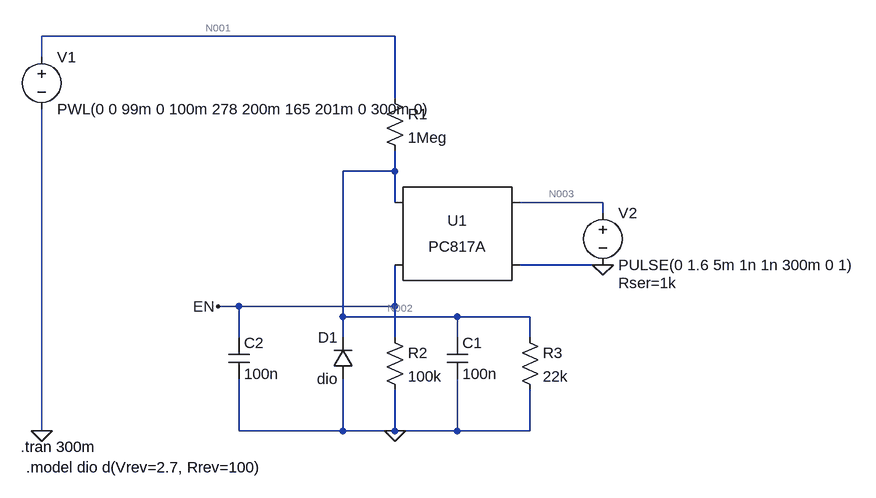
[diagram p0: schematic Startup.asc]
Startup.asc, the LTspice schematic file:
Version 4
SHEET 1 1084 680
WIRE 352 -176 -192 -176
WIRE -192 -144 -192 -176
WIRE 352 -80 352 -176
WIRE 352 32 352 0
WIRE 352 32 272 32
WIRE 352 80 352 32
WIRE 672 80 544 80
WIRE 672 96 672 80
WIRE 672 176 544 176
WIRE 112 240 80 240
WIRE 352 240 352 176
WIRE 352 240 112 240
WIRE 272 256 272 32
WIRE 448 256 272 256
WIRE 560 256 448 256
WIRE 112 288 112 240
WIRE 272 288 272 256
WIRE 352 288 352 240
WIRE 448 288 448 256
WIRE 560 288 560 256
WIRE -192 432 -192 -64
WIRE 112 432 112 352
WIRE 272 432 272 352
WIRE 272 432 112 432
WIRE 352 432 352 368
WIRE 352 432 272 432
WIRE 448 432 448 352
WIRE 448 432 352 432
WIRE 560 432 560 368
WIRE 560 432 448 432
FLAG 352 432 0
FLAG -192 432 0
FLAG 672 176 0
FLAG 80 240 EN
SYMBOL voltage -192 -160 R0
WINDOW 123 0 0 Left 0
WINDOW 39 0 0 Left 0
SYMATTR InstName V1
SYMATTR Value PWL(0 0 99m 0 100m 278 200m 165 201m 0 300m 0)
SYMBOL res 336 -96 R0
SYMATTR InstName R1
SYMATTR Value 1Meg
SYMBOL cap 432 288 R0
SYMATTR InstName C1
SYMATTR Value 100n
SYMBOL Optos\\PC817A 448 128 M0
SYMATTR InstName U1
SYMBOL voltage 672 80 R0
WINDOW 123 0 0 Left 0
WINDOW 39 24 124 Left 2
SYMATTR SpiceLine Rser=1k
SYMATTR InstName V2
SYMATTR Value PULSE(0 1.6 5m 1n 1n 300m 0 1)
SYMBOL cap 96 288 R0
SYMATTR InstName C2
SYMATTR Value 100n
SYMBOL res 544 272 R0
SYMATTR InstName R3
SYMATTR Value 22k
SYMBOL res 336 272 R0
SYMATTR InstName R2
SYMATTR Value 100k
SYMBOL diode 288 352 R180
WINDOW 0 24 64 Left 2
WINDOW 3 24 0 Left 2
SYMATTR InstName D1
SYMATTR Value dio
TEXT -224 456 Left 2 !.tran 300m
TEXT -216 488 Left 2 !.model dio d(Vrev=2.7, Rrev=100)

The netlist it stands for:
* Startup.asc
V1 N001 0 PWL(0 0 99m 0 100m 278 200m 165 201m 0 300m 0)
R1 N001 N002 1Meg
C1 N002 0 100n
XU1 N003 0 N002 EN PC817 Igain=1m
V2 N003 0 PULSE(0 1.6 5m 1n 1n 300m 0 1) Rser=1k
C2 EN 0 100n
R3 N002 0 22k
R2 EN 0 100k
D1 0 N002 dio
.model D D
.lib standard.dio
.tran 300m
.model dio d(Vrev=2.7, Rrev=100)
.lib PC817.sub
.backanno
.end

* Results of the author's LTspice run, read from the files saved beside the schematic
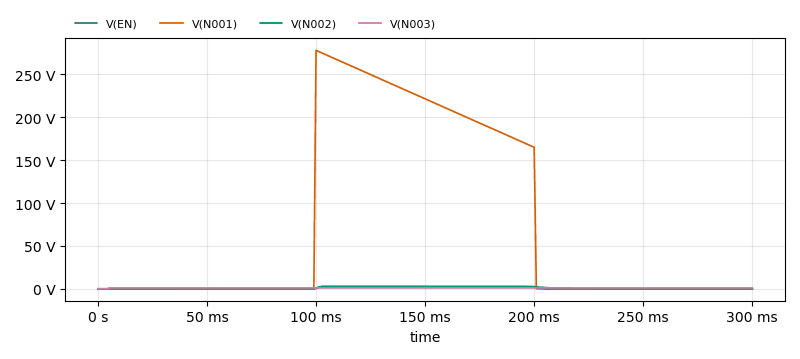
[diagram p1: Transient Analysis of Startup.asc, plotted from the saved traces]
* Transient Analysis, 1 run:
*   V(EN): min 0 V, max 2.627 V, average 935.7 mV, rms 1.53 V, last 298.2 µV
*   V(N001): min 0 V, max 278 V, average 74.57 V, rms 130.3 V, last 0 V
*   V(N002): min 0 V, max 2.71 V, average 913.6 mV, rms 1.556 V, last 0 V
*   V(N003): min 0 V, max 1.003 V, average 983.8 mV, rms 992.1 mV, last 1 V